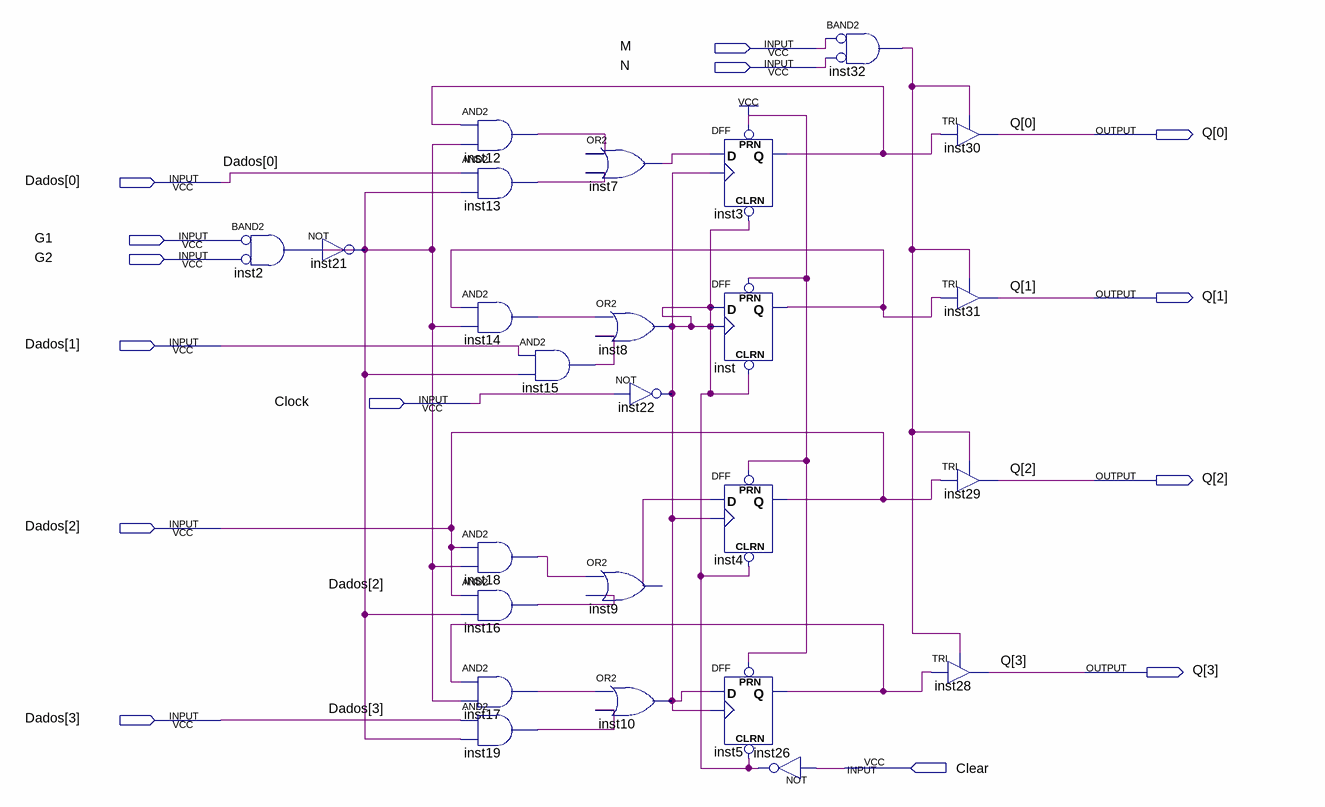
[diagram p0: schematic sheet]
// Quartus schematic register_74LS173.bdf as structural Verilog: 25 symbols, 14 pins
module register_74LS173 (
  input  M,
  input  N,
  input  [3:0] Dados,
  input  G1,
  input  G2,
  input  Clock,
  input  Clear,
  output [3:0] Q
);

  wire inst2_out, inst3_q, inst5_q, inst7_out, inst8_out, inst9_out, inst12_out, inst13_out, inst14_out,
       inst15_out, inst16_out, inst17_out, inst18_out, inst19_out, inst32_out, inst_q;

  and inst2 (inst2_out, ~G1, ~G2);  // BAND2
  not inst21 (inst2_out, inst2_out);
  and inst12 (inst12_out, inst3_q, inst2_out);
  and inst13 (inst13_out, Dados[0], inst2_out);
  and inst14 (inst14_out, inst_q, inst2_out);
  and inst18 (inst18_out, Dados[2], inst2_out);
  and inst16 (inst16_out, Dados[2], inst2_out);
  and inst17 (inst17_out, inst5_q, inst2_out);
  and inst19 (inst19_out, Dados[3], inst2_out);
  and inst15 (inst15_out, Dados[1], inst2_out);
  or inst7 (inst7_out, inst12_out, inst13_out);
  or inst8 (inst8_out, inst14_out, inst15_out);
  not inst22 (inst8_out, Clock);
  or inst9 (inst9_out, inst18_out, inst16_out);
  or inst10 (inst8_out, inst17_out, inst19_out);
  DFF inst3 (.CLRN(inst8_out), .CLK(inst8_out), .D(inst7_out), .PRN(1'b1), .Q(inst3_q));
  DFF inst (.CLRN(inst8_out), .CLK(inst8_out), .D(inst8_out), .PRN(1'b1), .Q(inst_q));
  DFF inst4 (.CLRN(inst8_out), .CLK(inst8_out), .D(inst9_out), .PRN(1'b1), .Q(Dados[2]));
  DFF inst5 (.CLRN(inst8_out), .CLK(inst8_out), .D(inst8_out), .PRN(1'b1), .Q(inst5_q));
  not inst26 (inst8_out, Clear);
  and inst32 (inst32_out, ~M, ~N);  // BAND2
  TRI inst28 (.IN(inst5_q), .OE(inst32_out), .OUT(Q[3]));
  TRI inst30 (.IN(inst3_q), .OE(inst32_out), .OUT(Q[0]));
  TRI inst31 (.IN(inst_q), .OE(inst32_out), .OUT(Q[1]));
  TRI inst29 (.IN(Dados[2]), .OE(inst32_out), .OUT(Q[2]));
endmodule
